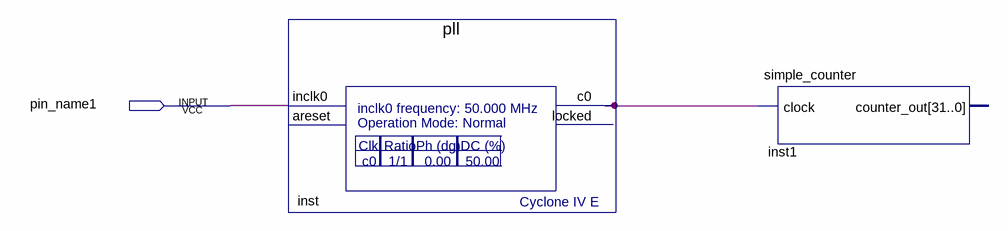
[diagram p0: schematic sheet]
// Quartus schematic BInaryCounterToDisplay.bdf as structural Verilog: 2 symbols, 1 pins
module BInaryCounterToDisplay (
  input  pin_name1
);

  wire inst_c0;

  pll inst (.inclk0(pin_name1), .c0(inst_c0));  // open: areset, locked
  simple_counter inst1 (.clock(inst_c0));  // open: counter_out
endmodule
